# EAGLE schematic Grilo (EAGLE 7.2.0)
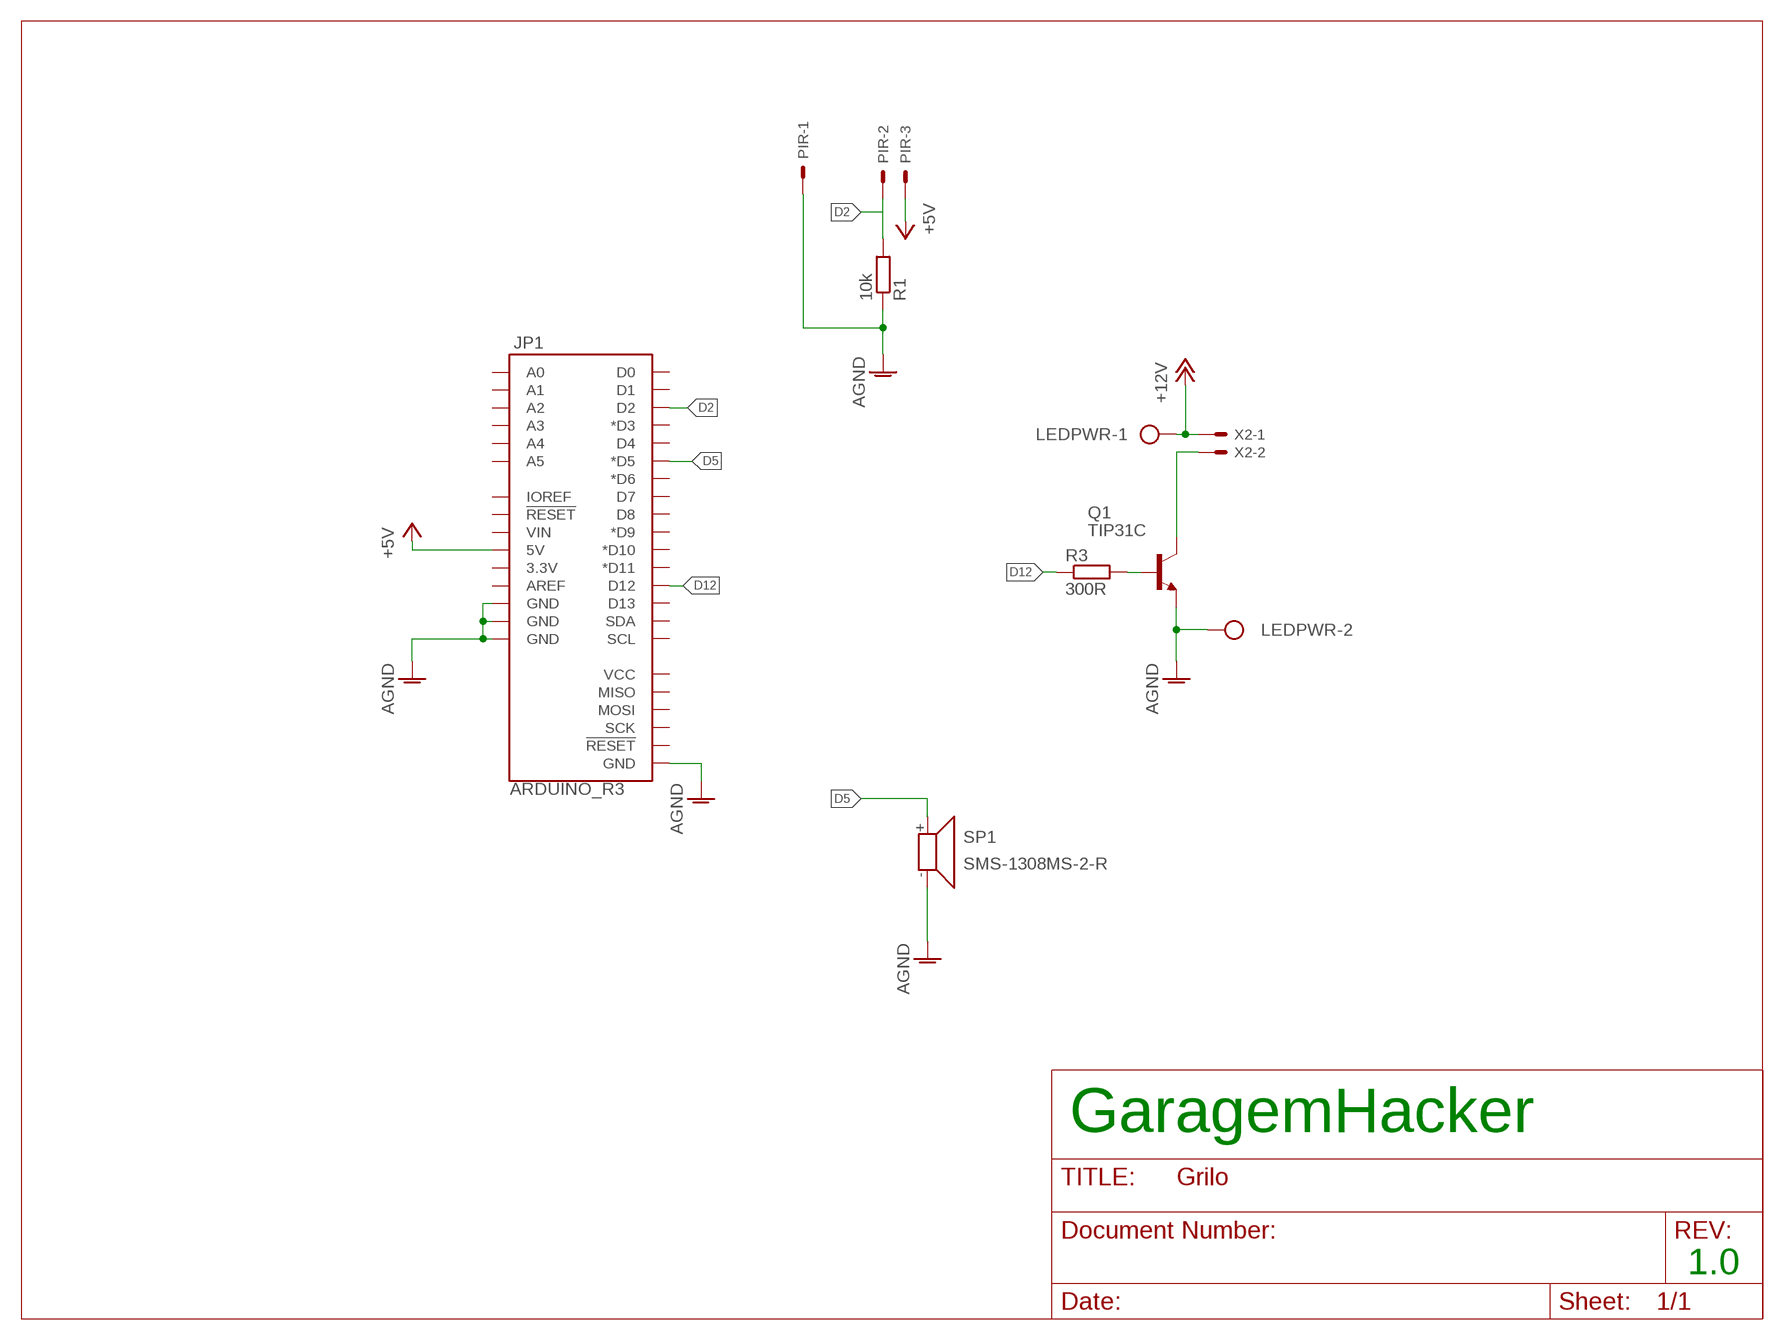
[diagram p0: schematic, sheet 1]

## Parts
JP1  ARDUINO_R3  [ARDUINO_R3]
LEDPWR  AK500/2  [AK500/2]
PIR  KK-156-3  [KK-156-3]
Q1  TIP31C  [TO220V]
R1  10k  R-EU_0207/10  [0207/10]
R3  300R  R-EU_0207/10  [0207/10]
SP1  SMS-1308MS-2-R  [SMS-1308MS-2-R]
X2  KK-156-2  [KK-156-2]

## Nets
+5V: JP1.5V PIR.3
+12V: LEDPWR.1 X2.1
AGND: JP1.GND@1(GND) JP1.GND@2(GND) JP1.GND@3(GND) JP1.GND@4(GND) LEDPWR.2 PIR.1 Q1.3(E) R1.1 SP1.-
D2: JP1.D2 PIR.2 R1.2
D5: JP1.D5(*D5) SP1.+
D12: JP1.D12 R3.1
N$1: Q1.1(B) R3.2
N$2: Q1.2(C) X2.2
Unconnected: JP1.3.3V JP1.A0 JP1.A1 JP1.A2 JP1.A3 JP1.A4 JP1.A5 JP1.AREF JP1.D0 JP1.D1 JP1.D3(*D3) JP1.D4 JP1.D6(*D6) JP1.D7 JP1.D8 JP1.D9(*D9) JP1.D10(*D10) JP1.D11(*D11) JP1.D13 JP1.IOREF JP1.MISO JP1.MOSI JP1.RESET@1(!RESET!) JP1.RESET@2(!RESET!) JP1.SCK JP1.SCL JP1.SDA JP1.VCC JP1.VIN

## Notes on the sheet
- GaragemHacker
- 1.0

## Library data of the parts
JP1 = SparkFun-Boards:ARDUINO_R3: Arduino R3 Footprint (w/ SPI header)
LEDPWR = con-ptr500:AK500/2: CONNECTOR; OC_FARNELL: unknown; OC_NEWARK: unknown
PIR = con-molex:KK-156-3: KK 156 HEADER Source: http://www.molex.com/pdm_docs/sd/026604100_sd.pdf; OC_FARNELL: unknown; OC_NEWARK: unknown
Q1 = transistor-npn:TIP31C*: NPN Transistor
R1 R3 = resistor:R-EU_: RESISTOR, European symbol
SP1 = speaker:SMS-1308MS-2-R: Speaker 13 x 13mm, 8 Ohm, 0.7W Source: pui audio inc. SMS-1308MS-2-R.pdf
X2 = con-molex:KK-156-2: KK 156 HEADER Source: http://www.molex.com/pdm_docs/sd/026604100_sd.pdf; OC_FARNELL: unknown; OC_NEWARK: unknown